# EAGLE design EchoFlex-ArduinoNanoSense-V1 (EAGLE 7.4.0)
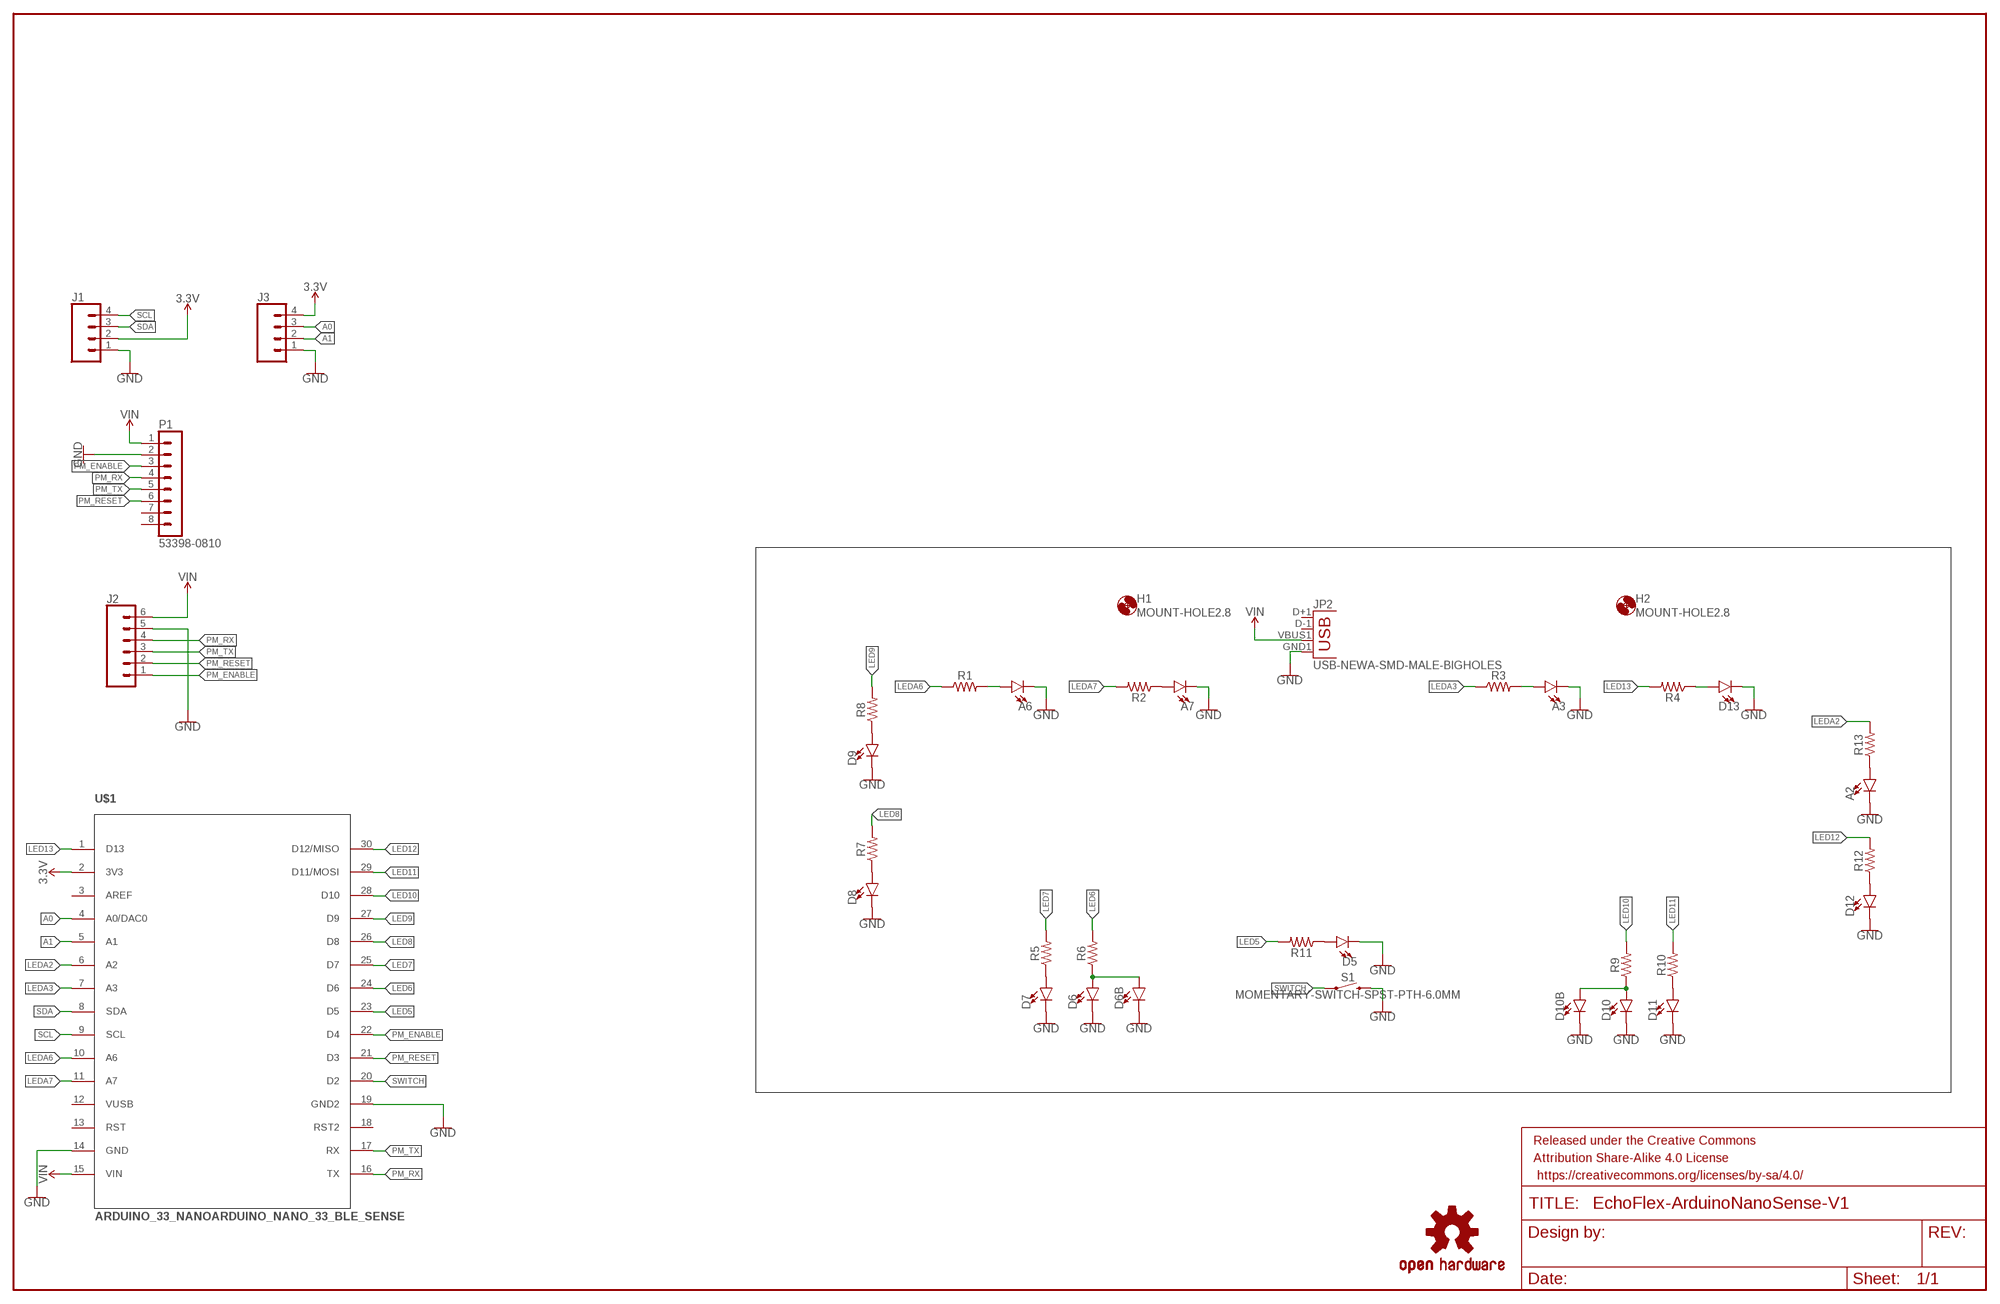
[diagram p0: schematic, sheet 1]

## Parts
A2  LED1206  [LED-1206]
A3  LED1206  [LED-1206]
A6  LED1206  [LED-1206]
A7  LED1206  [LED-1206]
D5  LED1206  [LED-1206]
D6  LED1206  [LED-1206]
D6B  LED1206  [LED-1206]
D7  LED1206  [LED-1206]
D8  LED1206  [LED-1206]
D9  LED1206  [LED-1206]
D10  LED1206  [LED-1206]
D10B  LED1206  [LED-1206]
D11  LED1206  [LED-1206]
D12  LED1206  [LED-1206]
D13  LED1206  [LED-1206]
FRAME1  FRAME-LEDGER  [CREATIVE_COMMONS]
H1  MOUNT-HOLE2.8  [2,8]
H2  MOUNT-HOLE2.8  [2,8]
J1  CONN_04SMD2  [JST04_1MM_RA]
J2  CONN_06SILK_FEMALE_PTH  [1X06]
J3  CONN_04  [1X04]
JP2  USB-NEWA-SMD-MALE-BIGHOLES  [USB-A-SMT-MALE]
LOGO1  OSHW-LOGOM  [OSHW-LOGO-M]
P1  53398-0810  [53398-0810]
R1  RESISTOR0805  [0805]
R2  RESISTOR0805  [0805]
R3  RESISTOR0805  [0805]
R4  RESISTOR0805  [0805]
R5  RESISTOR0805  [0805]
R6  RESISTOR0805  [0805]
R7  RESISTOR0805  [0805]
R8  RESISTOR0805  [0805]
R9  RESISTOR0805  [0805]
R10  RESISTOR0805  [0805]
R11  RESISTOR0805  [0805]
R12  RESISTOR0805  [0805]
R13  RESISTOR0805  [0805]
S1  MOMENTARY-SWITCH-SPST-PTH-6.0MM  [TACTILE_SWITCH_PTH_6.0MM]
U$1  ARDUINO_33_NANOARDUINO_NANO_33_BLE_SENSE  [ARDUINO_NANO_33]

## Nets
3.3V: J1.2 J3.4 U$1.2(3V3)
A0: J3.3 U$1.4(A0/DAC0)
A1: J3.2 U$1.5(A1)
GND: A2.C A3.C A6.C A7.C D5.C D6.C D6B.C D7.C D8.C D9.C D10.C D10B.C D11.C D12.C D13.C J1.1 J2.5 J3.1 JP2.GND1(GND) P1.2 S1.3 U$1.14(GND) U$1.19(GND2)
LED5: R11.2 U$1.23(D5)
LED6: R6.2 U$1.24(D6)
LED7: R5.2 U$1.25(D7)
LED8: R7.2 U$1.26(D8)
LED9: R8.2 U$1.27(D9)
LED10: R9.2 U$1.28(D10)
LED11: R10.2 U$1.29(D11/MOSI)
LED12: R12.2 U$1.30(D12/MISO)
LED13: R4.2 U$1.1(D13)
LEDA2: R13.2 U$1.6(A2)
LEDA3: R3.1 U$1.7(A3)
LEDA6: R1.1 U$1.10(A6)
LEDA7: R2.2 U$1.11(A7)
N$1: D12.A R12.1
N$2: D7.A R5.1
N$3: D6.A D6B.A R6.1
N$4: D8.A R7.1
N$5: A6.A R1.2
N$6: A7.A R2.1
N$7: A3.A R3.2
N$8: D13.A R4.1
N$9: D9.A R8.1
N$10: D10.A D10B.A R9.1
N$11: D11.A R10.1
N$12: D5.A R11.1
N$13: A2.A R13.1
PM_ENABLE: J2.1 P1.3 U$1.22(D4)
PM_RESET: J2.2 P1.6 U$1.21(D3)
PM_RX: J2.4 P1.4 U$1.16(TX)
PM_TX: J2.3 P1.5 U$1.17(RX)
SCL: J1.4 U$1.9(SCL)
SDA: J1.3 U$1.8(SDA)
SWITCH: S1.1 U$1.20(D2)
VIN: J2.6 JP2.VBUS1(VBUS) P1.1 U$1.15(VIN)
Unconnected: JP2.D+1(D+) JP2.D-1(D-) P1.7 P1.8 U$1.3(AREF) U$1.13(RST) U$1.18(RST2)

## Power pins joined to a net without a drawn wire
VUSB: U$1.12(VUSB)

## Library data of the parts
A2 A3 A6 A7 D5 D6 D6B D7-D10 D10B D11-D13 = ThingySticks:LED: LED (Generic) Standard schematic elements and footprints for 5mm, 3mm, 1206, and 0603 sized LEDs. Generic LEDs with no color specified.
FRAME1 = SparkFun-Aesthetics:FRAME-LEDGER: Schematic Frame - Ledger Standard 11x14 US Ledger frame
H1 H2 = ThingySticks:MOUNT-HOLE: MOUNTING HOLE with drill center marker
J1 = ThingySticks:CONN_04: Multi connection point. Often used as Generic Header-pin footprint for 0.1 inch spaced/style header connections On any of the 0.1 inch spaced packages, you can populate with these: Break Away Headers - Straight <https://www.sparkfun.com/products/116> (PRT-00116) Break Away Male Headers - Right Angle <https://www.sparkfun.com/products/553> (PRT-00553) Female Headers <https://www.sparkfun.com/products/115> (PRT-00115) Break Away Headers - Machine Pin <https://www.sparkfun.com/products/117> (PRT-00117) Break Away Female Headers - Swiss Machine Pin <https://www.sparkfun.com/products/743> (PRT-00743) For SCREWTERMINALS and SPRING TERMINALS visit here: Screw Terimnals on SparkFun.com <https://www.sparkfun.com/search/results?term=Screw+Terminals> (5mm/3.5mm/2.54mm spacing) This device is also useful as a general connection point to wire up your design to another part of your project. Our various solder wires solder well into these plated through hole pads. Hook-Up Wire - Assortment (Stranded, 22 AWG) <https://www.sparkfun.com/products/11375> (PRT-11375) Hook-Up Wire - Assortment (Solid Core, 22 AWG) <https://www.sparkfun.com/products/11367> (PRT-11367) View the entire wire category on our website here <https://www.sparkfun.com/categories/141> Special notes: Molex polarized connector foot print use with SKU : PRT-08231 with associated crimp pins and housings. 1MM SMD Version SKU: PRT-10208; PROD_ID: CONN-10310; SF_ID: PRT-10208
J2 = SparkFun-Connectors:CONN_06: Multi connection point. Often used as Generic Header-pin footprint for 0.1 inch spaced/style header connections On any of the 0.1 inch spaced packages, you can populate with these: Break Away Headers - Straight <https://www.sparkfun.com/products/116> (PRT-00116) Break Away Male Headers - Right Angle <https://www.sparkfun.com/products/553> (PRT-00553) Female Headers <https://www.sparkfun.com/products/115> (PRT-00115) Break Away Headers - Machine Pin <https://www.sparkfun.com/products/117> (PRT-00117) Break Away Female Headers - Swiss Machine Pin <https://www.sparkfun.com/products/743> (PRT-00743) Arduino Stackable Header - 6 Pin <https://www.sparkfun.com/products/9280> (PRT-09280) For SCREWTERMINALS and SPRING TERMINALS visit here: Screw Terimnals on SparkFun.com <https://www.sparkfun.com/search/results?term=Screw+Terminals> (5mm/3.5mm/2.54mm spacing) This device is also useful as a general connection point to wire up your design to another part of your project. Our various solder wires solder well into these plated through hole pads. Hook-Up Wire - Assortment (Stranded, 22 AWG) <https://www.sparkfun.com/products/11375> (PRT-11375) Hook-Up Wire - Assortment (Solid Core, 22 AWG) <https://www.sparkfun.com/products/11367> (PRT-11367) View the entire wire category on our website here <https://www.sparkfun.com/categories/141>; PROD_ID: CONN-08437
J3 = ThingySticks:CONN_04: Multi connection point. Often used as Generic Header-pin footprint for 0.1 inch spaced/style header connections On any of the 0.1 inch spaced packages, you can populate with these: Break Away Headers - Straight <https://www.sparkfun.com/products/116> (PRT-00116) Break Away Male Headers - Right Angle <https://www.sparkfun.com/products/553> (PRT-00553) Female Headers <https://www.sparkfun.com/products/115> (PRT-00115) Break Away Headers - Machine Pin <https://www.sparkfun.com/products/117> (PRT-00117) Break Away Female Headers - Swiss Machine Pin <https://www.sparkfun.com/products/743> (PRT-00743) For SCREWTERMINALS and SPRING TERMINALS visit here: Screw Terimnals on SparkFun.com <https://www.sparkfun.com/search/results?term=Screw+Terminals> (5mm/3.5mm/2.54mm spacing) This device is also useful as a general connection point to wire up your design to another part of your project. Our various solder wires solder well into these plated through hole pads. Hook-Up Wire - Assortment (Stranded, 22 AWG) <https://www.sparkfun.com/products/11375> (PRT-11375) Hook-Up Wire - Assortment (Solid Core, 22 AWG) <https://www.sparkfun.com/products/11367> (PRT-11367) View the entire wire category on our website here <https://www.sparkfun.com/categories/141> Special notes: Molex polarized connector foot print use with SKU : PRT-08231 with associated crimp pins and housings. 1MM SMD Version SKU: PRT-10208; PROD_ID: CONN-09696
JP2 = Tinamous:USB-NEW: USB Connectors USB-B-PTH is fully proven SKU : PRT-00139/CONN-08278 USB-miniB is fully proven SKU : PRT-00587 USB-A-PCB is untested. USB-A-H is throughly reviewed, but untested. Spark Fun Electronics SKU : PRT-00437 USB-B-SMT is throughly reviewed, but untested. Needs silkscreen touching up. USB-A-S has not been used/tested USB-MB-H has not been used/tested USB-MICROB has been used. CONN-09505
LOGO1 = SparkFun-Aesthetics:OSHW-LOGO: Open-Source Hardware (OSHW) Logo This logo indicates the piece of hardware it is found on incorporates a OSHW license and/or adheres to the definition of open source hardware found here: http://freedomdefined.org/OSHW
P1 = con-molex-picoblade:53398-0810: HEADER
R1-R13 = SparkFun-Resistors:RESISTOR: Generic Resistor Package
S1 = ThingySticks:MOMENTARY-SWITCH-SPST: Momentary Switch (Pushbutton) - SPST Normally-open (NO) SPST momentary switches (buttons, pushbuttons). Variants PTH-12MM - 12mm square, through-hole Momentary Pushbutton Switch - 12mm Square <https://www.sparkfun.com/products/9190> (COM-09190) PTH-6.0MM, PTH-6.0MM-KIT - 6.0mm square, through-hole Mini Pushbutton Switch <https://www.sparkfun.com/products/97> (COM-00097) KIT package intended for soldering kit's - only one side of pads' copper is exposed. PTH-RIGHT-ANGLE-KIT - Right-angle, through-hole Right Angle Tactile Button <https://www.sparkfun.com/products/10791> - Used on SparkFun BigTime Watch Kit <https://www.sparkfun.com/products/11734> SMD-12MM - 12mm square, surface-mount Tactile Button - SMD (12mm) <https://www.sparkfun.com/products/12993> (COM-12993) Used on SparkFun PicoBoard <https://www.sparkfun.com/products/11888> SMD-4.5MM - 4.5mm Square Trackball Switch Used on SparkFun Blackberry Trackballer Breakout <https://www.sparkfun.com/products/13169> SMD-4.6MMX2.8MM - 4.60mm x 2.80mm, surface mount Used on SparkFun SAMD21 Mini Breakout <https://www.sparkfun.com/products/13664> SMD-5.2MM, SMD-5.2-REDUNDANT - 5.2mm square, surface-mount Mini Pushbutton Switch - SMD <https://www.sparkfun.com/products/8720> (COM-08720) Used on Arduino Pro Mini <https://www.sparkfun.com/products/11114> REDUNDANT package connects both switch circuits together SMD-6.0X3.5MM - 6.0 x 3.5mm, surface mount Momentary Reset Switch SMD <https://www.sparkfun.com/products/8229> (COM-08229) SMD-6.2MM-TALL - 6.2mm square, surface mount Tactile Button - SMD (6mm) <https://www.sparkfun.com/products/12992> Used on SparkFun Digital Sandbox <https://www.sparkfun.com/products/12651> SMD-RIGHT-ANGLE - Right-angle, surface mount Used on SparkFun Block for Intel® Edison - Arduino <https://www.sparkfun.com/products/13036>; PROD_ID: SWCH-08441; SF_SKU: COM-00097
U$1 = ThingySticks:ARDUINO_33_NANO: https://store.arduino.cc/nano-33-iot

## Board
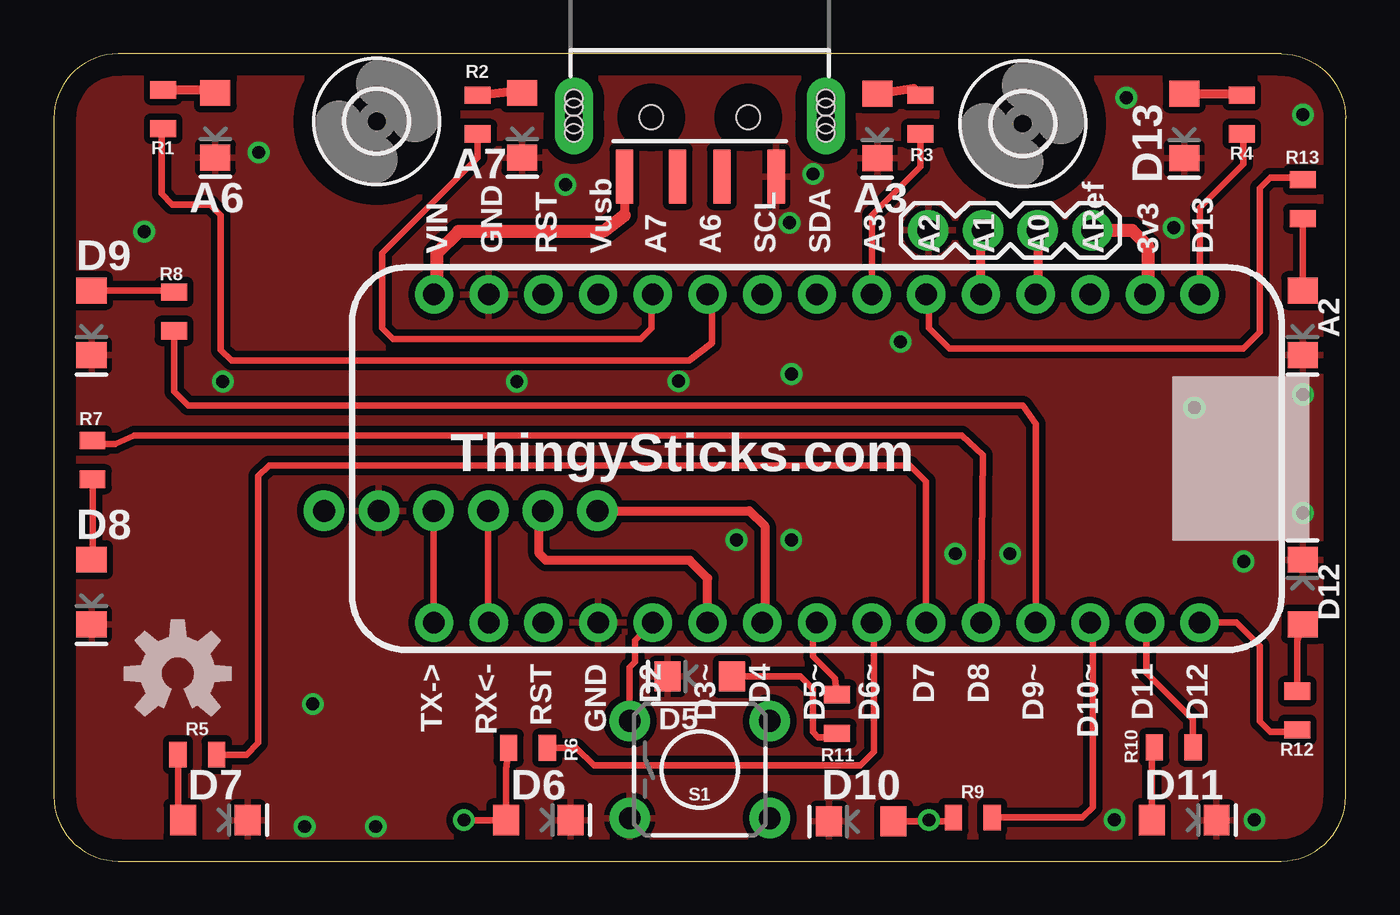
[diagram p1: board, top side]
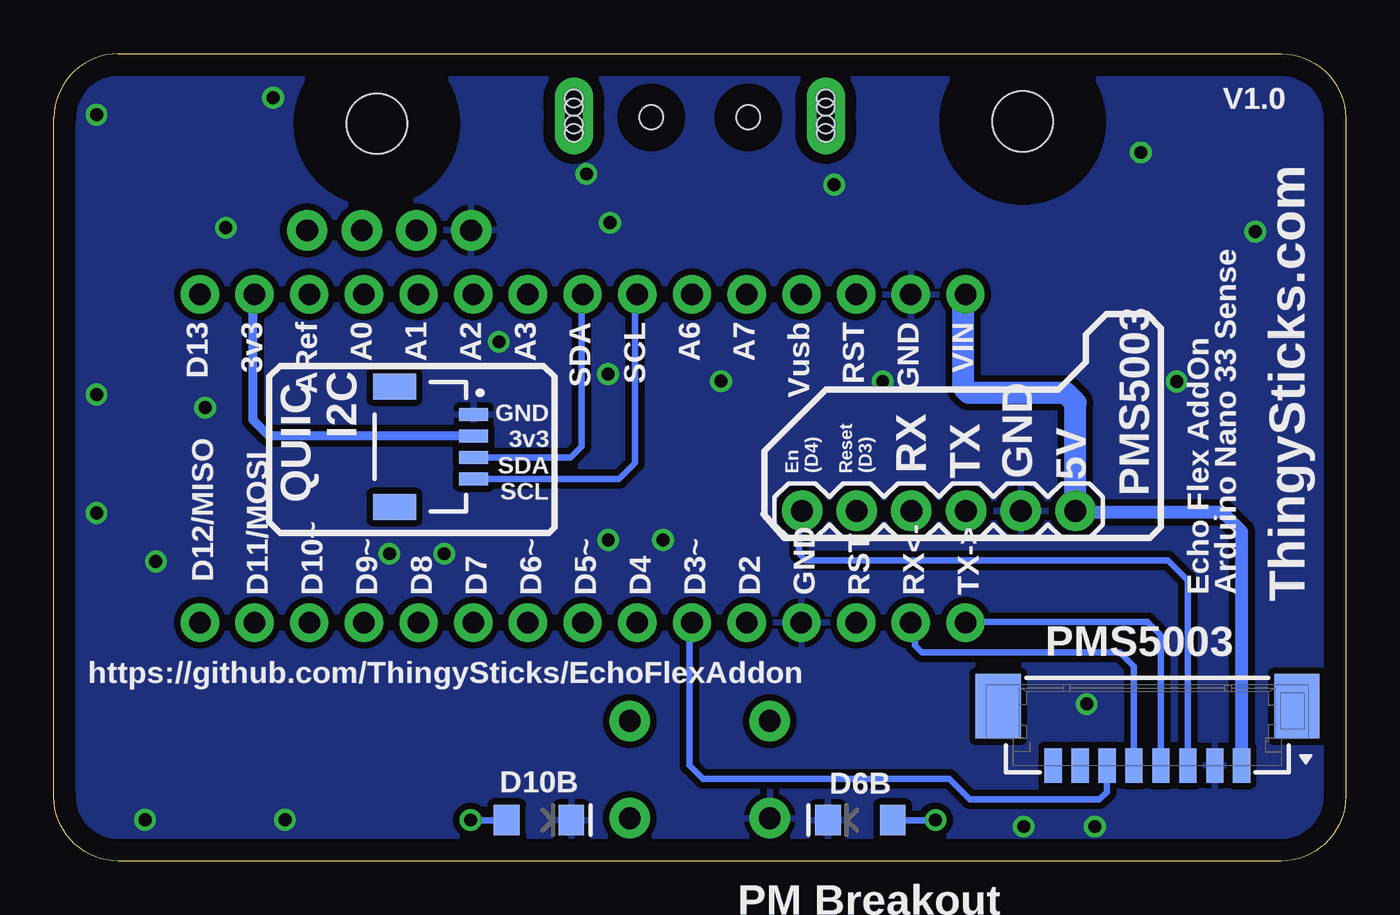
[diagram p2: board, bottom side, seen from below]

Size 60 x 37.5 mm. Coordinates in mm from the lower left corner, seen from the top.
Outline: 3,0 57,0 arc90 60,3 60,34.5 arc90 57,37.5 3,37.5 arc90 0,34.5 0,3 arc90 3,0
Copper layers (1*16): Top 0.035mm / dielectric 1.5mm / Bottom 0.035mm
Design rules "default": minimum track width 10mil, minimum drill 0.6mm, track to track 8mil, track to pad 8mil, pad to pad 8mil, via to via 8mil, smd to smd 8mil, copper to edge 40mil, drill to drill 8mil, minimum pad ring 10mil, minimum via ring 8mil, stop-mask expansion 4mil, vias tented up to drill 0mil, thermal gap 10mil

### Footprints (pad centres in the part's own frame; a part is rotated, then mirrored left to right if it is on the bottom)
LED-1206 = smd 1.2 x 1.4: A -1.5,0; C 1.5,0
2,8 = hole 2.8: 0,0
JST04_1MM_RA = smd 0.6 x 1.35: 1 -1.5,0; 2 -0.5,0; 3 0.5,0; 4 1.5,0 | smd 1.2 x 2: NC1 2.8,-3.675; NC2 -2.8,-3.675
1X06 = drill 1.016 pad 1.88: 1 0,0; 2 2.54,0; 3 5.08,0; 4 7.62,0; 5 10.16,0; 6 12.7,0
1X04 = drill 1.016 pad 1.88: 1 0,0; 2 2.54,0; 3 5.08,0; 4 7.62,0
USB-A-SMT-MALE = smd 2.5 x 0.8: D+1 10.95,1.027; D-1 10.95,-1.027; GND1 10.95,3.551; VBUS1 10.95,-3.5 | drill 0.8 pad 1.778 long: SHLD1 8.13,-5.85; SHLD2 8.13,5.85 | hole 1.1: 8.2,2.25; 8.2,-2.25 | hole 0.8: 8.53,-5.85; 8.93,-5.85; 7.73,-5.85; 7.33,-5.85; 8.53,5.85; 8.93,5.85; 7.73,5.85; 7.33,5.85
53398-0810 = smd 0.8 x 1.6: 1 4.375,0; 2 3.125,0; 3 1.875,0; 4 0.625,0; 5 -0.625,0; 6 -1.875,0; 7 -3.125,0; 8 -4.375,0 | smd 2.1 x 3: M1 6.935,2.75; M2 -6.935,2.75
0805 = smd 0.8 x 1.2: 1 -0.9,0; 2 0.9,0
TACTILE_SWITCH_PTH_6.0MM = drill 1.016 pad 1.88: 1 -3.251,2.261; 2 3.251,2.261; 3 -3.251,-2.261; 4 3.251,-2.261
ARDUINO_NANO_33 = drill 1 pad 1.778: 1 1.27,-3.81; 2 1.27,-6.35; 3 1.27,-8.89; 4 1.27,-11.43; 5 1.27,-13.97; 6 1.27,-16.51; 7 1.27,-19.05; 8 1.27,-21.59; 9 1.27,-24.13; 10 1.27,-26.67; 11 1.27,-29.21; 12 1.27,-31.75; 13 1.27,-34.29; 14 1.27,-36.83; 15 1.27,-39.37; 16 16.51,-39.37; 17 16.51,-36.83; 18 16.51,-34.29; 19 16.51,-31.75; 20 16.51,-29.21; 21 16.51,-26.67; 22 16.51,-24.13; 23 16.51,-21.59; 24 16.51,-19.05; 25 16.51,-16.51; 26 16.51,-13.97; 27 16.51,-11.43; 28 16.51,-8.89; 29 16.51,-6.35; 30 16.51,-3.81

### Placement (x,y rotation side)
A2  58,25 270 top
A3  38.25,34.15 270 top
A6  7.5,34.18 270 top
A7  21.75,34.18 270 top
D5  30,8.57 180 top
D6  22.5,1.91 0 top
D6B  22.54,1.91 180 bottom
D7  7.5,1.91 0 top
D8  1.75,12.5 270 top
D9  1.75,25 270 top
D10  37.5,1.84 180 top
D10B  37.47,1.91 0 bottom
D11  52.5,1.91 0 top
D12  58,12.5 90 top
D13  52.5,34.15 270 top
FRAME1  22.86,-10.16 0 top  (outside the outline)
H1  15,34.36 0 top
H2  45,34.26 0 top
J1  40.5,19.25 270 bottom
J2  25.25,16.27 0 bottom
J3  40.61,29.3 0 top
JP2  30,42.75 270 top
LOGO1  5.76,8.71 0 top
P1  9.21,4.45 0 bottom
R1  5.08,34.92 90 top
R2  19.68,34.67 270 top
R3  40.26,34.67 90 top
R4  55.18,34.67 270 top
R5  6.67,4.95 0 top
R6  22.02,5.26 0 top
R7  1.8,18.64 90 top
R8  5.58,25.54 270 top
R9  42.69,2.02 0 top
R10  52.01,5.28 0 top
R11  36.38,6.83 90 top
R12  57.75,7 270 top
R13  58,30.75 90 top
S1  30,4.25 0 top
U$1  57.03,27.59 270 top

### Tracks (layer width: path | path; a pad name or v marks a point on that pad's centre or on a via)
3.3V
  Top 0.61: J3.4 50.08,29.3 50.8,28.57 50.8,26.44 U$1.2
  Bottom 0.406: J1.2 50,19.75 50.75,20.5 50.75,26.25 U$1.2
A0
  Top 0.406: J3.3 45.7,26.41 U$1.4
A1
  Top 0.406: U$1.5 43.06,29.2 J3.2
GND  (via drill 0.6)
  other vias: 4.2,29.24 11.65,1.6 14.95,1.6 49.26,1.92 55.76,1.92 58.01,16.17 58.01,21.67 49.81,35.46 35.26,31.92 9.51,32.92 23.76,31.42 34.17,29.65 21.5,22.27 29.01,22.29 39.33,24.12 52.97,21.06 55.26,13.92 58.01,34.67 52.01,29.42 34.26,22.62 34.25,14.91 31.71,14.91 41.87,14.28 44.41,14.28 7.85,22.27 12.03,7.29
  pour Top (isolate 0.305): 3,37.5 57,37.5 arc-90 60,34.5 60,3 arc-90 57,0 3,0 arc-90 0,3 0,34.5 arc-90
  pour Bottom (isolate 0.305): 57,37.5 arc-90 60,34.5 60,3 arc-90 57,0 2.5,0 arc-90 0,2.5 0,34.5 arc-90 3,37.5
LED5
  Top 0.305: R11.2 36.27,8.48 35.25,9.5 35.25,10.89 U$1.23
LED6
  Top 0.305: R6.2 24.27,5.26 25.08,4.45 37.47,4.45 38.1,5.08 38.1,10.96 U$1.24
LED7
  Top 0.305: R5.2 8.95,4.95 9.5,5.5 9.5,17.89 10,18.39 39.75,18.39 40.5,17.64 40.5,11.44 U$1.25
LED8
  Top 0.305: U$1.26 43.15,18.87 42.18,19.77 3.73,19.77 2.86,19.37 1.97,19.37 R7.2
LED9
  Top 0.305: R8.2 5.58,21.82 6.25,21.16 45,21.16 45.6,20.3 U$1.27
LED10
  Top 0.305: R9.2 47.77,2.02 48.25,2.5 48.25,10.97 U$1.28
LED11
  Top 0.305: R10.2 52.91,6.59 50.75,8.75 50.75,11 50.76,11 U$1.29
LED12
  Top 0.305: U$1.30 54.92,11.08 56,10 56,6.5 56.5,6 57.65,6 R12.2
LED13
  Top 0.305: U$1.1 53.22,30.36 55.24,32.38 55.24,33.71 R4.2
LEDA2
  Top 0.305: R13.2 57.9,31.75 56.5,31.75 56,31.25 56,24.57 55.24,23.81 41.59,23.81 40.64,24.77 40.64,26.2 U$1.6
LEDA3
  Top 0.305: R3.1 40.26,32.26 38,30 38,26.34 U$1.7
LEDA6
  Top 0.305: R1.1 5,33.95 5,31 5.5,30.5 7.25,30.5 7.75,30 7.75,23.75 8.25,23.25 29.5,23.25 30.57,24.07 30.57,26.11 U$1.10
LEDA7
  Top 0.305: R2.2 19.68,32.69 15.25,28.25 15.25,24.75 15.75,24.25 27.25,24.25 27.75,24.75 27.75,26.25 U$1.11
N$1
  Top 0.305: R12.1 57.75,10.25 D12.A
N$2
  Top 0.305: R5.1 5.77,2.14 D7.A
N$3  (via drill 0.6)
  Top 0.305: R6.1 21,4.25 D6.A v19.05,1.91
  Bottom 0.305: v19.05,1.91 D6B.A
N$4
  Top 0.305: 1.89,14.14 D8.A 1.8,14.05 R7.1
N$5
  Top 0.406: R1.2 7.39,35.83 A6.A
N$6
  Top 0.406: R2.1 21.89,35.83 A7.A
N$7
  Top 0.406: A3.A 39.93,35.9 R3.2
N$8
  Top 0.406: D13.A 55.35,35.65 R4.1
N$9
  Top 0.305: D9.A 5.52,26.5 R8.1
N$10  (via drill 0.6)
  Top 0.305: R9.1 41.6,1.84 D10.A 40.58,1.84 v40.64,1.91
  Bottom 0.305: v40.64,1.91 D10B.A
N$11
  Top 0.305: D11.A 51,4.86 R10.1
N$12
  Top 0.305: D5.A 34.68,8.57 35.25,8 35.25,6 35.5,5.75 36.3,5.75 R11.1
N$13
  Top 0.305: R13.1 A2.A
PM_ENABLE
  Top 0.406: J2.1 32.31,16.27 33.02,15.56 33.02,11.2 U$1.22
  Bottom 0.305: J2.1 25.4,16.12 25.4,14.29 25.08,13.97 8.26,13.97 7.33,13.05 P1.3
PM_RESET
  Top 0.406: U$1.21 30.36,13.14 29.53,13.97 22.86,13.97 22.54,14.29 22.54,16.1 J2.2
  Bottom 0.305: P1.6 11.08,3.21 11.43,2.86 17.46,2.86 18.41,3.81 29.84,3.81 30.48,4.45 30.48,10.96 U$1.21
PM_RX
  Top 0.305: J2.4 17.63,11.11 U$1.16
  Bottom 0.305: P1.4 8.58,10.49 9.21,11.11 17.63,11.11 U$1.16
PM_TX
  Top 0.305: J2.3 20.17,11.11 U$1.17
  Bottom 0.305: P1.5 9.83,9.04 10.48,9.69 19.68,9.69 20,10.01 20,10.88 U$1.17
SCL
  Bottom 0.305: J1.4 33.75,17.75 33,18.5 33,26.22 U$1.9
SDA
  Bottom 0.305: J1.3 36,18.75 35.5,19.25 35.5,26.26 U$1.8
SWITCH
  Top 0.305: S1.1 26.75,9 27,9.25 27,10.26 U$1.20
VIN
  Top 0.406: JP2.VBUS1 26.5,30
  Top 0.61: 26.5,30 25.5,29.25 18.79,29.25 17.78,28.24 17.78,26.94 U$1.15
  Bottom 0.61: P1.1 4.83,15.31 5.71,16.19 12.47,16.19 J2.6
  Bottom 1.016: J2.6 12.55,21.3 13,21.75 17.5,21.75 17.75,22 17.75,26.23 U$1.15

### Text on the board
tNames: ThingySticks.com
bNames: V1.0 | PMS5003 | QUIIC / I2C | GND / 3v3 / SDA / SCL | 5V | GND | TX | RX | Reset / (D3) | En / (D4) | ThingySticks.com | Arduino Nano 33 Sense | Echo Flex AddOn | PMS5003 | https://github.com/ThingySticks/EchoFlexAddon | PM Breakout